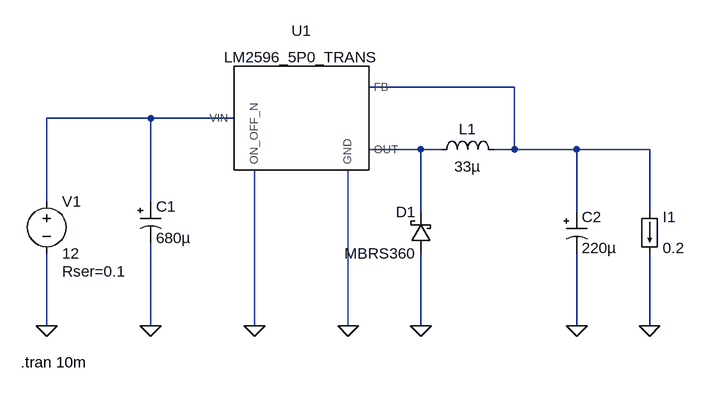
[diagram p0: schematic LM2596.asc]
LM2596.asc, the LTspice schematic file:
Version 4
SHEET 1 880 680
WIRE 528 112 304 112
WIRE -32 160 -192 160
WIRE 96 160 -32 160
WIRE 384 208 304 208
WIRE 416 208 384 208
WIRE 528 208 528 112
WIRE 528 208 496 208
WIRE 624 208 528 208
WIRE 736 208 624 208
WIRE -192 288 -192 160
WIRE -32 288 -32 160
WIRE 384 304 384 208
WIRE 624 304 624 208
WIRE 736 304 736 208
WIRE -192 480 -192 368
WIRE -32 480 -32 352
WIRE 128 480 128 240
WIRE 272 480 272 240
WIRE 384 480 384 368
WIRE 624 480 624 368
WIRE 736 480 736 368
FLAG -192 480 0
FLAG -32 480 0
FLAG 384 480 0
FLAG 624 480 0
FLAG 736 480 0
FLAG 128 480 0
FLAG 272 480 0
SYMBOL AutoGenerated\\LM2596_5P0_TRANS 96 240 R0
SYMATTR InstName U1
SYMBOL voltage -192 272 R0
WINDOW 123 0 0 Left 0
WINDOW 39 24 124 Left 2
SYMATTR SpiceLine Rser=0.1
SYMATTR InstName V1
SYMATTR Value 12
SYMBOL polcap -48 288 R0
WINDOW 3 24 56 Left 2
SYMATTR Value 680µ
SYMATTR InstName C1
SYMATTR Description Capacitor
SYMATTR Type cap
SYMATTR SpiceLine V=16 Irms=985m Rser=0.1 Lser=0
SYMBOL polcap 608 304 R0
WINDOW 3 24 56 Left 2
SYMATTR Value 220µ
SYMATTR InstName C2
SYMATTR Description Capacitor
SYMATTR Type cap
SYMATTR SpiceLine V=10 Irms=180m Rser=0.1 Lser=0
SYMBOL schottky 400 368 R180
WINDOW 0 24 64 Left 2
WINDOW 3 24 0 Left 2
SYMATTR InstName D1
SYMATTR Value MBRS360
SYMATTR Description Diode
SYMATTR Type diode
SYMBOL load 720 304 R0
WINDOW 123 0 0 Left 0
WINDOW 39 0 0 Left 0
SYMATTR InstName I1
SYMATTR Value 0.2
SYMBOL ind 400 224 R270
WINDOW 0 32 56 VTop 2
WINDOW 3 5 56 VBottom 2
SYMATTR InstName L1
SYMATTR Value 33µ
TEXT -232 536 Left 2 !.tran 10m

The netlist it stands for:
* LM2596.asc
XU1 N002 N001 N003 0 0 LM2596_5P0_TRANS  ; pins VIN FB OUT GND ON_OFF_N
V1 N002 0 12 Rser=0.1
C1 N002 0 680µ V=16 Irms=985m Rser=0.1 Lser=0
C2 N001 0 220µ V=10 Irms=180m Rser=0.1 Lser=0
D1 0 N003 MBRS360
I1 N001 0 0.2
L1 N003 N001 33µ
.model D D
.lib standard.dio
.tran 10m
.lib \\Omv\hsrm\SS21\EL2 Pr\Pr2\LTSpice\lib\LM2596_5P0_TRANS.LIB
.backanno
.end